# EAGLE design project_step_down (EAGLE 8.5.0)
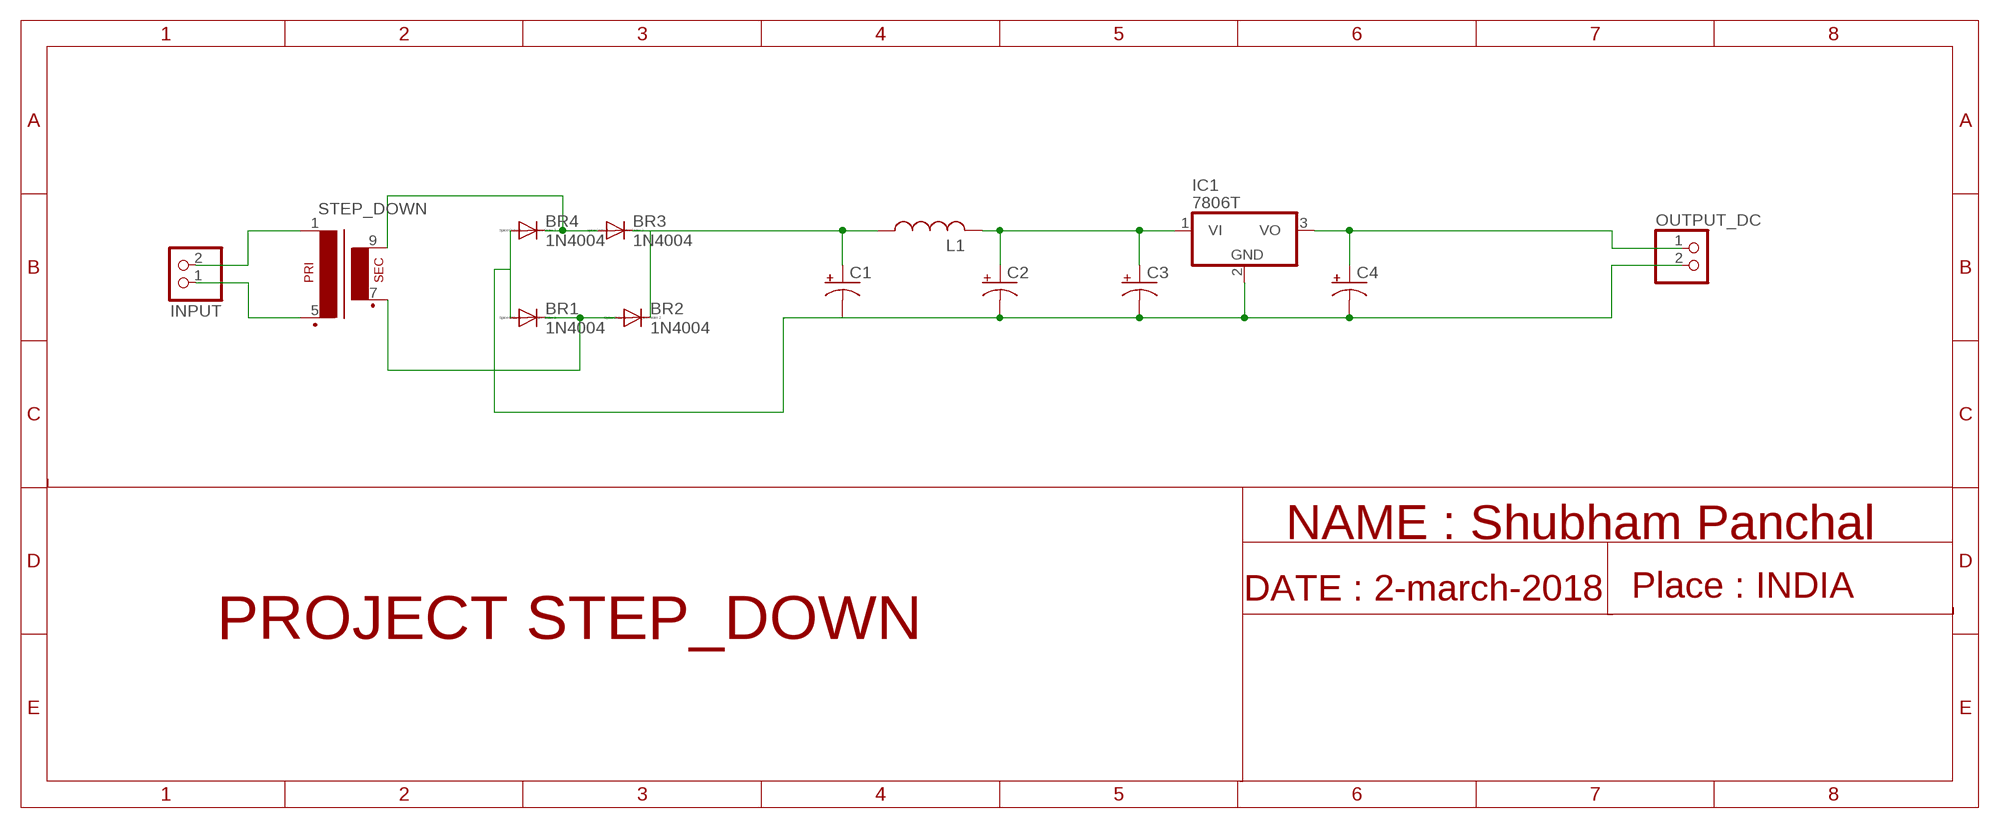
[diagram p0: schematic, sheet 1]

## Parts
BR1  1N4004  [DO41-10]
BR2  1N4004  [DO41-10]
BR3  1N4004  [DO41-10]
BR4  1N4004  [DO41-10]
C1  CPOL-USE2.5-7  [E2,5-7]
C2  CPOL-USE2.5-7  [E2,5-7]
C3  CPOL-USE2.5-7  [E2,5-7]
C4  CPOL-USE2.5-7  [E2,5-7]
IC1  7806T  [TO220H]
INPUT  PINHD-1X2  [1X02]
L1  L-US0204/7  [0204/7]
OUTPUT_DC  PINHD-1X2  [1X02]
STEP_DOWN  EI30-1  [EI30-1]

## Nets
GND: C1.- C2.- C3.- C4.- IC1.2(GND) OUTPUT_DC.2
N$1: INPUT.2 STEP_DOWN.1
N$2: INPUT.1 STEP_DOWN.5(P2)
N$3: BR3.A BR4.C STEP_DOWN.9(S4)
N$4: BR1.C BR2.A STEP_DOWN.7(S3)
N$5: BR1.A BR4.A
N$7: BR2.C BR3.C C1.+ L1.1
N$9: C2.+ C3.+ IC1.1(VI) L1.2
N$10: C4.+ IC1.3(VO) OUTPUT_DC.1

## Notes on the sheet
- NAME : Shubham Panchal
- DATE : 2-march-2018 | Place : INDIA
- PROJECT STEP_DOWN

## Library data of the parts
BR1-BR4 = diode:1N4004: DIODE general purpose rectifier, 1 A
C1-C4 = rcl:CPOL-US: POLARIZED CAPACITOR, American symbol; SPICEPREFIX: C
IC1 = linear:78*: Positive VOLTAGE REGULATOR Source: http://cache.national.com/ds/LM/LM78L05.pdf http://www.fairchildsemi.com/ds/LM/LM7805.pdf
INPUT OUTPUT_DC = pinhead:PINHD-1X2: PIN HEADER
L1 = rcl:L-US: INDUCTOR, American symbol; SPICEPREFIX: L
STEP_DOWN = trafo:EI30-1: TRANSFORMER 1 primary winding, 1 secondary winding ERA

## Board
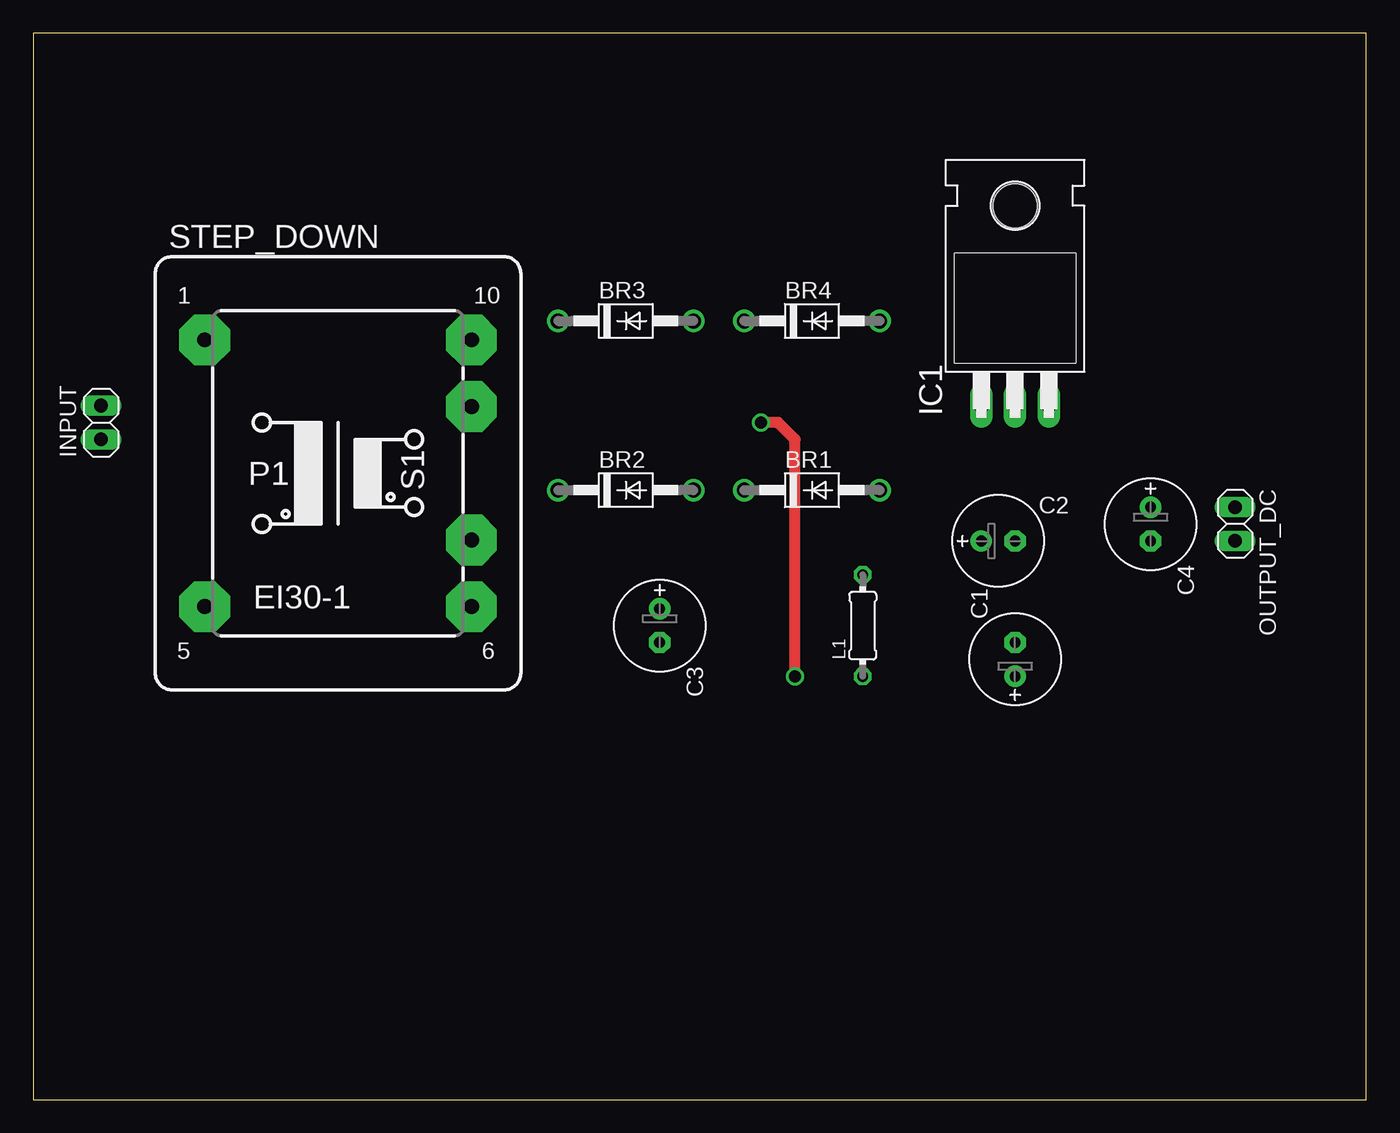
[diagram p1: board, top side]
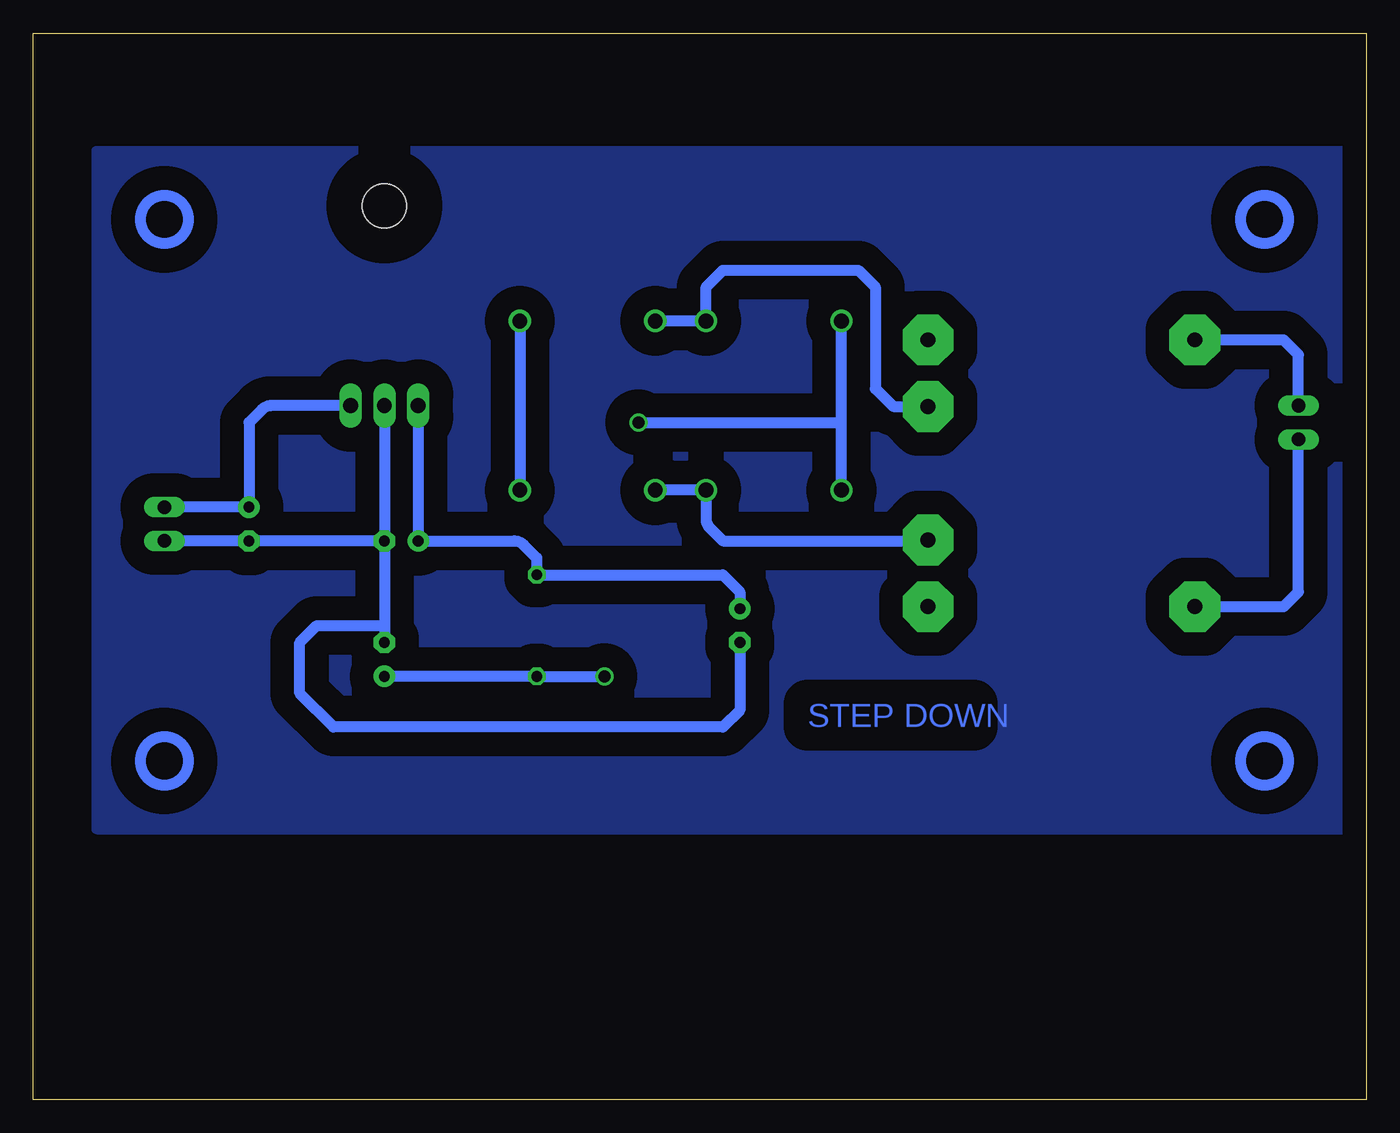
[diagram p2: board, bottom side, seen from below]

Size 100 x 80 mm. Coordinates in mm from the lower left corner, seen from the top.
Outline: 0,0 100,0 100,80 0,80 0,0
Copper layers (1*16): Top 0.035mm / dielectric 1.5mm / Bottom 0.035mm
Design rules "default": minimum track width 6mil, minimum drill 0.35mm, track to track 6mil, track to pad 6mil, pad to pad 6mil, via to via 6mil, smd to smd 6mil, copper to edge 40mil, drill to drill 6mil, minimum pad ring 10mil, minimum via ring 8mil, stop-mask expansion 4mil, vias tented up to drill 0mil, thermal gap 10mil

### Footprints (pad centres in the part's own frame; a part is rotated, then mirrored left to right if it is on the bottom)
DO41-10 = drill 1.118: A 5.08,0; C -5.08,0
E2,5-7 = drill 0.813 pad 1.6: + -1.27,0 | drill 0.813 pad 1.6 octagon: - 1.27,0
TO220H = drill 1.118 long: 1 -2.54,-10.16; 2 0,-10.16; 3 2.54,-10.16 | hole 3.302: 0,4.826
1X02 = drill 1.016 long: 1 -1.27,0; 2 1.27,0
0204/7 = drill 0.813 octagon: 1 -3.81,0; 2 3.81,0
EI30-1 = drill 1.118 pad 3.81 octagon: 1 -10.008,10.008; 5 -10.008,-10.008; 6 10.008,-10.008; 7 10.008,-5.004; 9 10.008,5.004; 10 10.008,10.008

### Placement (x,y rotation side)
BR1  58.42,45.72 0 top
BR2  44.45,45.72 0 top
BR3  44.45,58.42 0 top
BR4  58.42,58.42 0 top
C1  73.66,33.02 90 top
C2  72.39,41.91 0 top
C3  46.99,35.56 270 top
C4  83.82,43.18 270 top
IC1  73.66,62.23 0 top
INPUT  5.08,50.8 90 top
L1  62.23,35.56 90 top
OUTPUT_DC  90.17,43.18 270 top
STEP_DOWN  22.86,46.99 0 top

### Tracks (layer width: path | path; a pad name or v marks a point on that pad's centre or on a via)
GND
  Bottom 0.813: OUTPUT_DC.2 C4.- C2.- | IC1.2 C2.- | C2.- 73.66,35.56 | 73.66,35.56 C1.- | C3.- 46.99,29.21 48.26,27.94 77.47,27.94 80.01,30.48 80.01,34.29 78.74,35.56 73.66,35.56
N$1
  Top 0.152: 5.18,52.12 INPUT.2
  Bottom 0.813: INPUT.2 5.08,55.88 6.2,57 STEP_DOWN.1
N$2
  Top 0.152: 5.18,49.53 INPUT.1
  Bottom 0.813: STEP_DOWN.5 6.2,36.98 5.08,38.1 INPUT.1
N$3
  Bottom 0.813: BR4.C BR3.A 49.53,60.96 48.26,62.23 38.1,62.23 36.83,60.96 36.83,53.34 35.48,51.99 STEP_DOWN.9
N$4
  Bottom 0.813: BR1.C BR2.A 49.53,43.59 arc-45 49.24,42.89 48.26,41.91 32.94,41.91 STEP_DOWN.7
N$5
  Bottom 0.813: BR4.A BR1.A
N$6
  pour Bottom (isolate 1.778): 1.27,71.12 95.25,71.12 95.25,20.32 1.27,20.32
N$7  (via drill 0.9 pad 1.3)
  Top 0.813: v57.15,31.75 57.15,49.53 55.88,50.8 v54.61,50.8
  Bottom 0.152: 39.32,45.72 BR2.C | 39.32,58.37 BR3.C
  Bottom 0.813: C1.+ L1.1 v57.15,31.75 | BR2.C 39.37,50.8 | 39.37,50.8 BR3.C | v54.61,50.8 39.37,50.8
N$9
  Bottom 0.813: IC1.1 C2.+ 63.91,41.91 arc45 63.21,41.62 62.23,40.64 L1.2 48.26,39.37 46.99,38.1 C3.+
N$10
  Bottom 0.813: OUTPUT_DC.1 C4.+ 83.82,50.8 82.84,51.78 arc45 82.14,52.07 IC1.3
(copper drawn outside any net)
  shapes: Bottom circle x4

### Text on the board
Bottom: STEP DOWN